# Altium project PCB_Project_1.PrjPcb
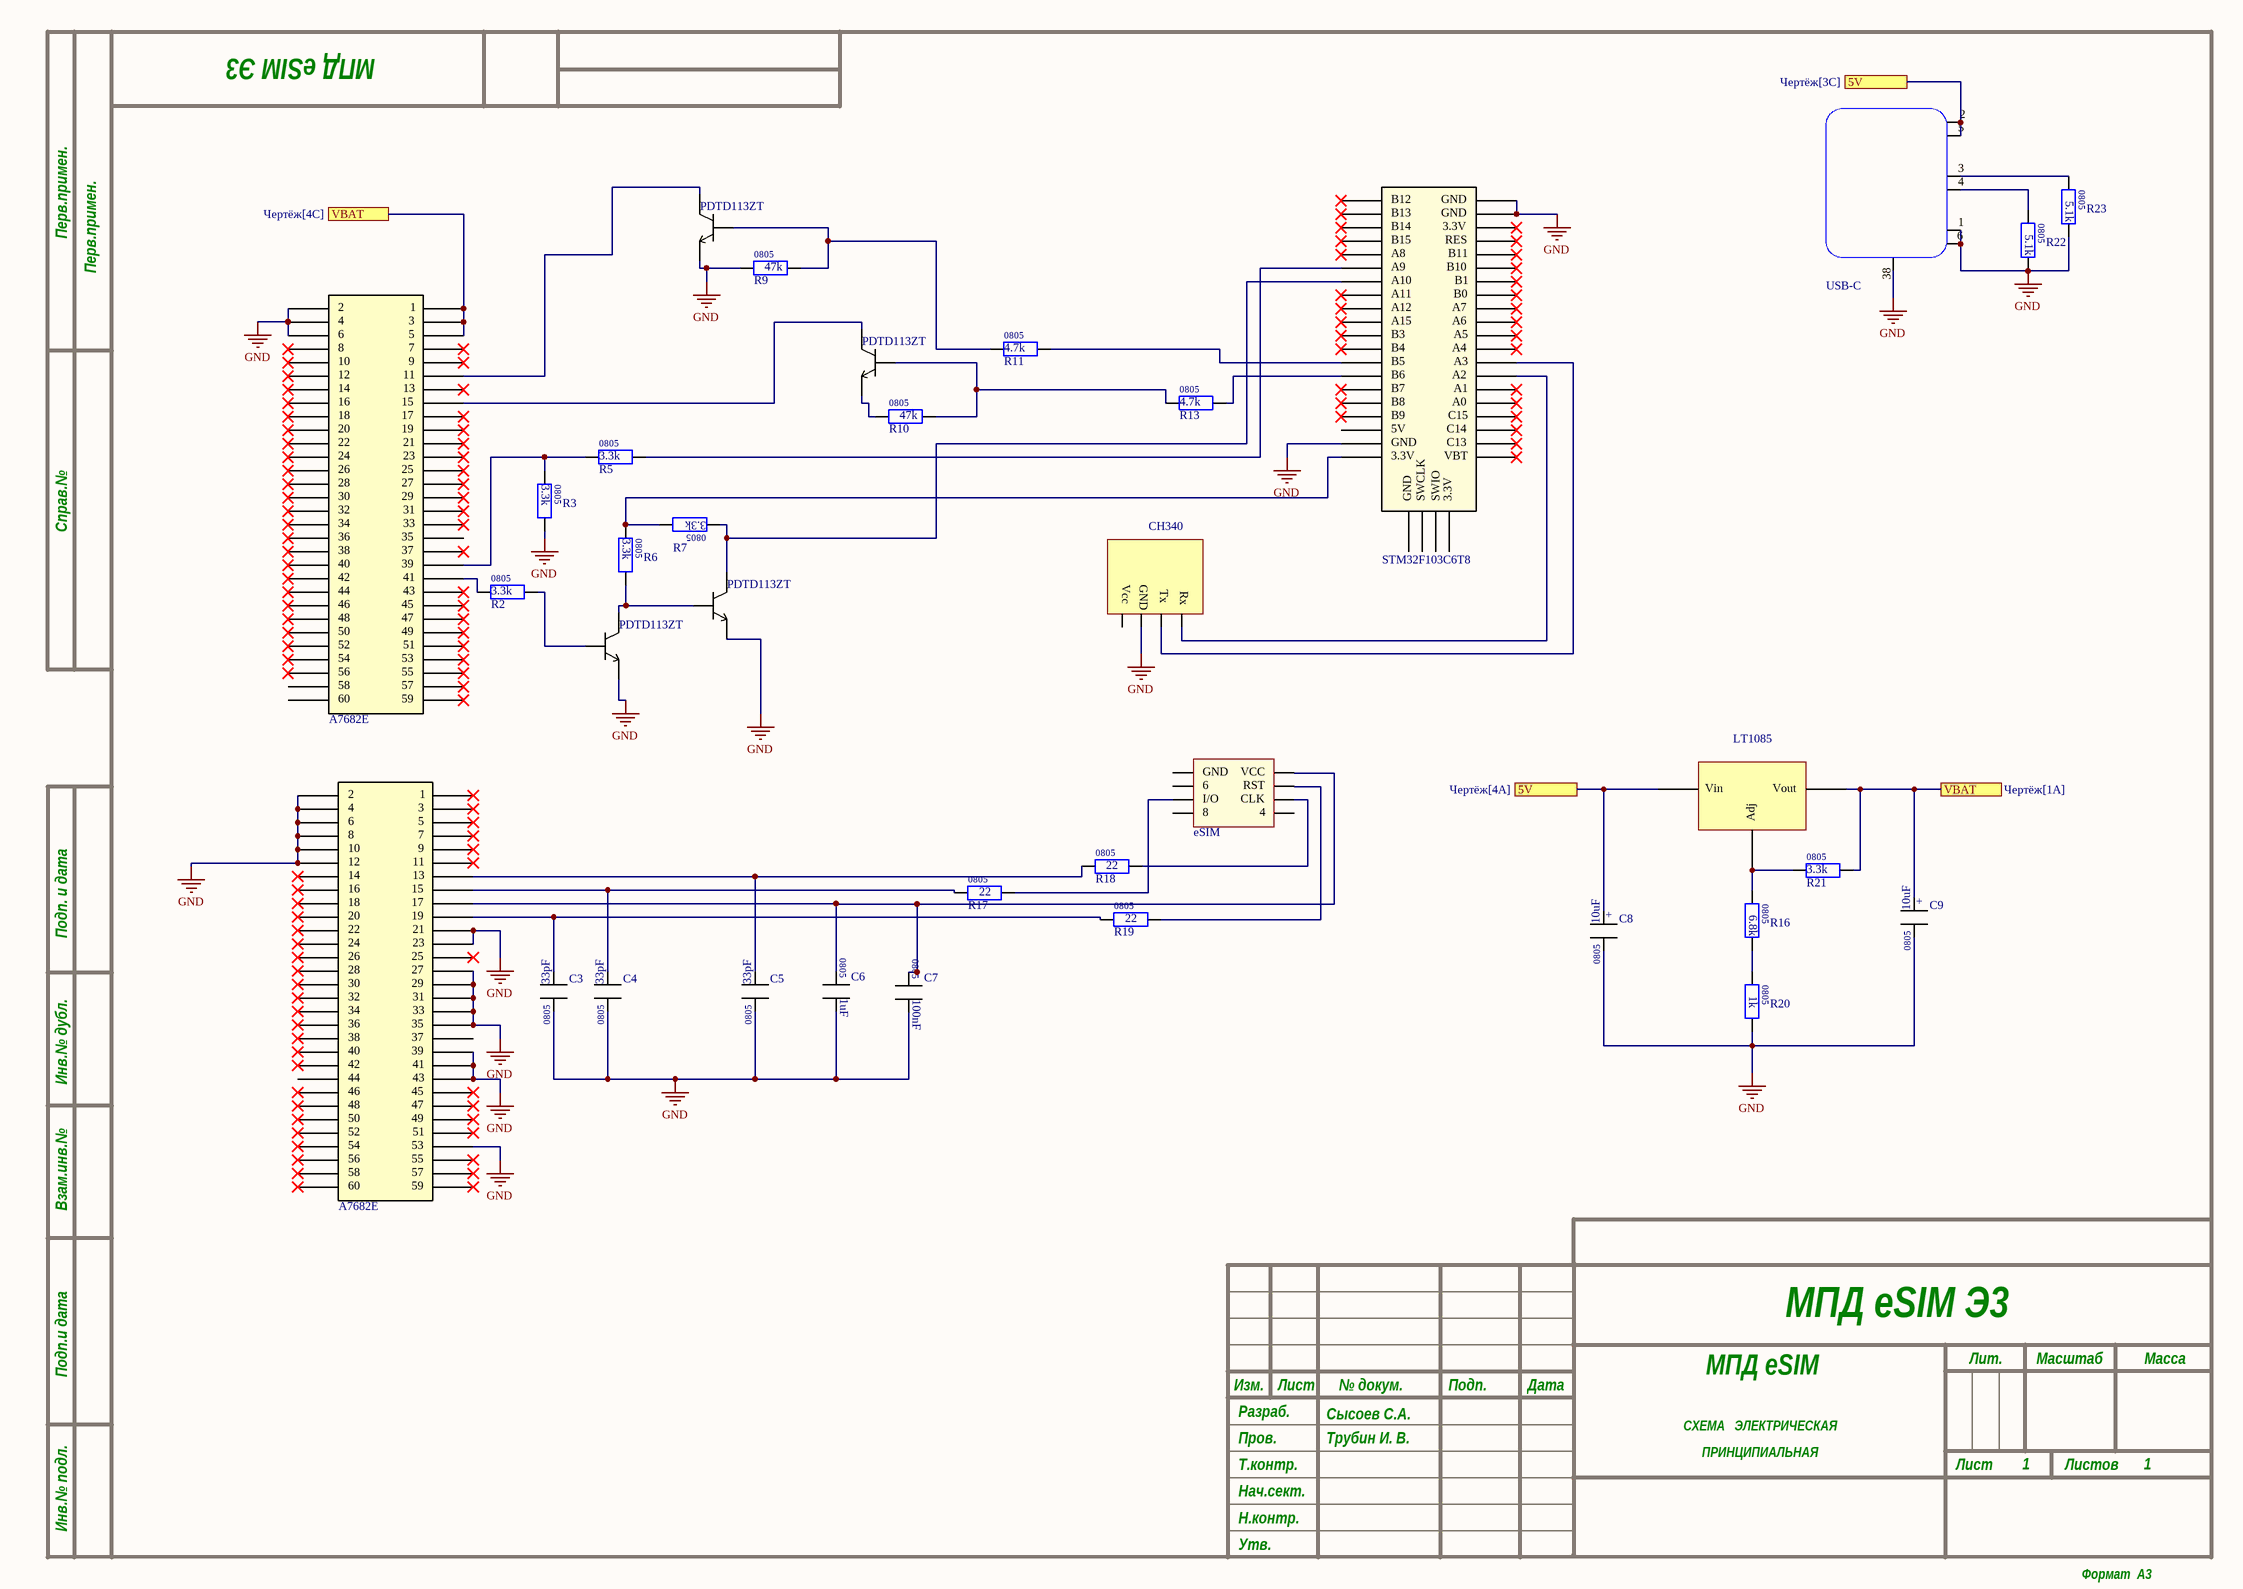
[diagram p0: Чертёж.SchDoc]
1 sheet, 35 parts. Net scope: flat (ports and power ports of the same name join across sheets).
Board file: PCB1.PcbDoc

## Sheet Чертёж.SchDoc
size 420 x 297 mm; CheckedBy: Трубин И. В.; Author: Сысоев С.А.; SheetNumber: 1; SheetTotal: 1; PageSetup: Record=PageOptions|CenterHorizontal=True|CenterVertical=True|PrintScale=0.94|XCorrection=1.00|YCorrection=1.00|PrintKind=1|BorderSize=5000000|LeftOffset=0|BottomOffset=0|Orientation=1|PaperLength=1000|PaperWidth=1000|Scale=100|PaperSource=7|PrintQuality=-4|MediaType=1|DitherType=10|PaperKind=A4|PrintScaleMode=1; DecimalNumber: МПД eSIM; MainDevice: Перв.примен.; Name1: МПД eSIM; DocumentName: Sheet1.SCHDOC

### Parts
A1  A7682E  [A7682]
A?  A7682E  [A7682]
C3  CC080533pF  [СС0805]  (value not drawn)
C4  CC080533pF  [СС0805]  (value not drawn)
C5  CC080533pF  [СС0805]  (value not drawn)
C6  capacitor  [СС0805]  (value not drawn)
C7  capacitor  [СС0805]  (value not drawn)
C8  capacitor  [CAP JAMOCON]  (value not drawn)
C9  capacitor  [CAP JAMOCON]  (value not drawn)
CH340?  CH340
eSIM?  eSIM  [eSIM]
LT?  LT1085  [LD1058-1]
PDTD1  transistor  [PDTD113ZT]  (value not drawn)
PDTD3  transistor  [PDTD113ZT]  (value not drawn)
PDTD4  transistor  [PDTD113ZT]  (value not drawn)
PDTD5  transistor  [PDTD113ZT]  (value not drawn)
R2  Resistor  [R0805]  (value not drawn)
R3  Resistor  [R0805]  (value not drawn)
R5  Resistor  [R0805]  (value not drawn)
R6  Resistor  [R0805]  (value not drawn)
R7  Resistor  [R0805]  (value not drawn)
R9  Resistor  [R0805]  (value not drawn)
R10  Resistor  [R0805]  (value not drawn)
R11  Resistor  [R0805]  (value not drawn)
R13  Resistor  [R0805]  (value not drawn)
R16  Resistor  [R0805]  (value not drawn)
R17  Resistor  [R0805]  (value not drawn)
R18  Resistor  [R0805]  (value not drawn)
R19  Resistor  [R0805]  (value not drawn)
R20  Resistor  [R0805]  (value not drawn)
R21  Resistor  [R0805]  (value not drawn)
R22  Resistor  [R0805]  (value not drawn)
R23  Resistor  [R0805]  (value not drawn)
STM1  STM32F103C6T8  [STM]
USB-C?  USB-C  [USB C]

### Ports
5V (see Чертёж[3C]), 5V (see Чертёж[4A]), VBAT (see Чертёж[1A]), VBAT (see Чертёж[4C])

### Nets
GND: A1.2 A1.4 A1.6 A?.2 A?.4 A?.6 A?.8 A?.10 A?.12 A?.21 A?.23 A?.27 A?.29 A?.31 A?.33 A?.35 A?.39 A?.41 A?.43 A?.53 C3.2 C4.2 C5.2 C6.2 C7.3 C8.3 C9.3 CH340?.33 PDTD3.6 PDTD4.6 PDTD5.6 R3.1 R9.0 R20.1 R22.1 R23.1 STM1.1(GND) STM1.2(GND) STM1.39(GND) USB-C?.1(GND) USB-C?.6(GND) USB-C?.38(SHIELD)
NetA1_1: A1.1 A1.3 A1.5 C9.2 LT?.Vout R21.1 ; port VBAT
NetA1_11: A1.11 PDTD5.5
NetA1_15: A1.15 PDTD1.5
NetA1_39: A1.39 R3.0 R5.0
NetA1_41: A1.41 R2.0
NetA?_13: A?.13 C5.3 R18.0
NetA?_15: A?.15 C4.3 R17.0
NetA?_17: A?.17 C6.3 C7.2
NetA?_19: A?.19 C3.3 R19.0
NetC8_2: C8.2 LT?.Vin USB-C?.2(VBAS) USB-C?.5(VBAS) ; port 5V
NetCH340?_34: CH340?.34 STM1.13(A3)
NetCH340?_35: CH340?.35 STM1.14(A2)
NeteSIM?_2: eSIM?.2(RST) R19.1
NeteSIM?_3: eSIM?.3(CLK) R18.1
NeteSIM?_7: eSIM?.7(I/O) R17.1
NetLT?_Adj: LT?.Adj R16.0 R21.0
NetPDTD1_4: PDTD1.4 R10.1 R13.0
NetPDTD1_6: PDTD1.6 R10.0
NetPDTD3_4: PDTD3.4 R2.1
NetPDTD3_5: PDTD3.5 PDTD4.4 R6.1
NetPDTD4_5: PDTD4.5 R7.0 STM1.27(A10)
NetPDTD5_4: PDTD5.4 R9.1 R11.0
NetR5_1: R5.1 STM1.26(A9)
NetR6_0: R6.0 R7.1 STM1.40(3.3V)
NetR11_1: R11.1 STM1.33(B5)
NetR13_1: R13.1 STM1.34(B6)
NetR16_1: R16.1 R20.0
NetR22_0: R22.0 USB-C?.4(CC2)
NetR23_0: R23.0 USB-C?.3(CC1)

Not connected (* = marked no-connect by the designer): A1 7* 8* 9* 10* 12* 13* 14* 16* 17* 18* 19* 20* 21* 22* 23* 24* 25* 26* 27* 28* 29* 30* 31* 32* 33* 34* 35 36* 37* 38* 40* 42* 43* 44* 45* 46* 47* 48* 49* 50* 51* 52* 53* 54* 55* 56* 57* 58 59* 60; A? 1* 3* 5* 7* 9* 11* 14* 16* 18* 20* 22* 24* 25* 26* 28* 30* 32* 34* 36* 37 38* 40* 42* 44 45* 46* 47* 48* 49* 50* 51* 52* 54* 55* 56* 57* 58* 59* 60*; CH340? 32; eSIM? 1(VCC) 4 5(GND) 6 8; STM1 3(3.3V)* 4(RES)* 5(B11)* 6(B10)* 7(B1)* 8(B0)* 9(A7)* 10(A6)* 11(A5)* 12(A4)* 15(A1)* 16(A0)* 17(C15)* 18(C14)* 19(C13)* 20(VBT)* 21(B12)* 22(B13)* 23(B14)* 24(B15)* 25(A8)* 28(A11)* 29(A12)* 30(A15)* 31(B3)* 32(B4)* 35(B7)* 36(B8)* 37(B9)* 38(5V) 41(GND) 42(SWCLK) 43(SWIO) 44(3.3V)

### Notes on the sheet
- Перв.примен.
- Справ.№
- Подп. и дата
- Инв.№ дубл.
- Взам.инв.№
- Подп.и дата
- Разраб.
- Изм.
- Лист
- № докум.
- Подп.
- Дата
- Лит.
- Масштаб
- Масса
- Т.контр.
- Пров.
- СХЕМА   ЭЛЕКТРИЧЕСКАЯ
- ПРИНЦИПИАЛЬНАЯ
- Листов
- Инв.№ подл.
- Утв.
- Н.контр.
- Нач.сект.
- Формат  A3
- (in symbol CC08051uF) 0805
- (in symbol CC080533pF) 0805
- (in symbol CC0805100nF) 0805
- (in symbol CE080510uF) +; 0805
- (in symbol CH340) Vcc; GND; Tx; Rx
- (in symbol CR08051kR) 0805
- (in symbol CR08053.3kR) 0805; 3.3k
- (in symbol CR08054.7kR) 0805
- (in symbol CR08055.1kR) 0805
- (in symbol CR08056.8kR) 0805
- (in symbol CR080522R) 0805
- (in symbol CR080547kR) 0805

### Library data of the parts
C3-C5 = CC080533pF: CC0805_33pF; Value: 33pF
C6 = CC08051uF: CC0805_1uF; Value: 1uF
C7 = CC0805100nF: CC0805_100nF; Value: 100nF
C8 C9 = CE080510uF: CE0805_10uF; Value: 10uF
PDTD1 PDTD3-PDTD5 = PDTD113ZT
R2 R3 R5-R7 R21 = CR08053.3kR: CR0805_3.3kR
R9 R10 = CR080547kR: CR0805_47kR; Value: 47k
R11 R13 = CR08054.7kR: CR0805_4.7kR; Value: 4.7k
R16 = CR08056.8kR: CR0805_6.8kR; Value: 6.8k
R17-R19 = CR080522R: CR0805_22R; Value: 22
R20 = CR08051kR: CR0805_1kR; Value: 1k
R22 R23 = CR08055.1kR: Value: 5.1k